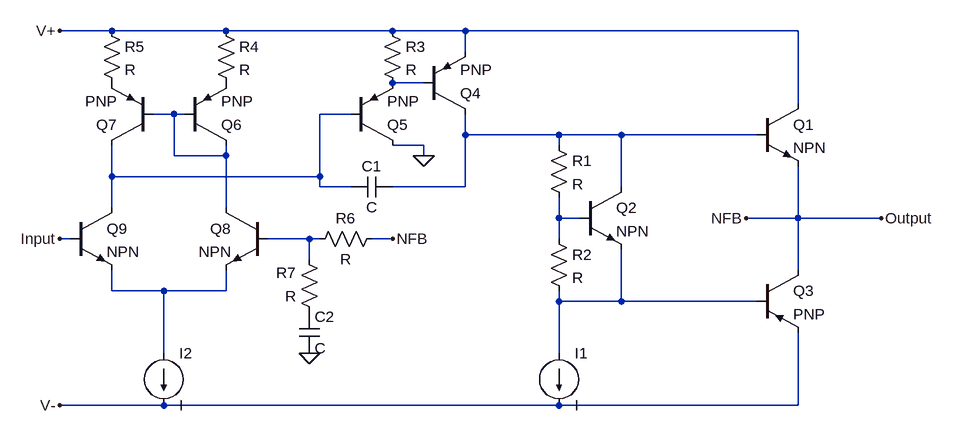
[diagram p0: schematic final_topology_pa.asc]
final_topology_pa.asc, the LTspice schematic file:
Version 4
SHEET 1 880 680
WIRE -576 -192 -656 -192
WIRE -400 -192 -576 -192
WIRE -144 -192 -400 -192
WIRE -32 -192 -144 -192
WIRE 480 -192 -32 -192
WIRE -32 -160 -32 -192
WIRE -96 -112 -144 -112
WIRE 480 -80 480 -192
WIRE -480 -64 -512 -64
WIRE -464 -64 -480 -64
WIRE -208 -64 -256 -64
WIRE -32 -32 -32 -64
WIRE 112 -32 -32 -32
WIRE 208 -32 112 -32
WIRE 416 -32 208 -32
WIRE -96 -16 -144 -16
WIRE 112 -16 112 -32
WIRE -480 0 -480 -64
WIRE -400 0 -400 -16
WIRE -400 0 -480 0
WIRE -96 0 -96 -16
WIRE -576 32 -576 -16
WIRE -256 32 -256 -64
WIRE -256 32 -576 32
WIRE -256 48 -256 32
WIRE -208 48 -256 48
WIRE -32 48 -32 -32
WIRE -32 48 -144 48
WIRE 208 48 208 -32
WIRE -576 80 -576 32
WIRE -400 80 -400 0
WIRE 112 96 112 64
WIRE 144 96 112 96
WIRE 480 96 480 16
WIRE 480 96 400 96
WIRE 608 96 480 96
WIRE -640 128 -656 128
WIRE -272 128 -336 128
WIRE -256 128 -272 128
WIRE -144 128 -176 128
WIRE 112 128 112 96
WIRE -272 160 -272 128
WIRE 480 176 480 96
WIRE -576 208 -576 176
WIRE -496 208 -576 208
WIRE -400 208 -400 176
WIRE -400 208 -496 208
WIRE 112 224 112 208
WIRE 208 224 208 144
WIRE 208 224 112 224
WIRE 416 224 208 224
WIRE -496 304 -496 208
WIRE 112 304 112 224
WIRE -496 384 -656 384
WIRE 112 384 -496 384
WIRE 480 384 480 272
WIRE 480 384 112 384
FLAG -96 0 0
FLAG 608 96 Output
FLAG 400 96 NFB
FLAG -272 304 0
FLAG -144 128 NFB
FLAG -656 128 Input
FLAG -656 -192 V+
FLAG -656 384 V-
SYMBOL npn 416 -80 R0
SYMATTR InstName Q1
SYMBOL npn 144 48 R0
SYMATTR InstName Q2
SYMBOL res 96 -32 R0
SYMATTR InstName R1
SYMBOL res 96 112 R0
SYMATTR InstName R2
SYMBOL pnp 416 176 R0
SYMATTR InstName Q3
SYMBOL current 112 304 R0
SYMATTR InstName I1
SYMBOL pnp -96 -64 M180
SYMATTR InstName Q4
SYMBOL pnp -208 -16 M180
SYMATTR InstName Q5
SYMBOL cap -144 32 R90
WINDOW 0 0 32 VBottom 2
WINDOW 3 32 32 VTop 2
SYMATTR InstName C1
SYMBOL res -160 -208 R0
SYMATTR InstName R3
SYMBOL pnp -464 -16 M180
SYMATTR InstName Q6
SYMBOL pnp -512 -16 R180
SYMATTR InstName Q7
SYMBOL npn -336 80 M0
SYMATTR InstName Q8
SYMBOL npn -640 80 R0
SYMATTR InstName Q9
SYMBOL res -416 -208 R0
SYMATTR InstName R4
SYMBOL res -592 -208 R0
SYMATTR InstName R5
SYMBOL current -496 304 R0
SYMATTR InstName I2
SYMBOL res -160 112 R90
WINDOW 0 0 56 VBottom 2
WINDOW 3 32 56 VTop 2
SYMATTR InstName R6
SYMBOL res -256 256 R180
WINDOW 0 36 76 Left 2
WINDOW 3 36 40 Left 2
SYMATTR InstName R7
SYMBOL cap -288 240 R0
SYMATTR InstName C2

The netlist it stands for:
* final_topology_pa.asc
Q1 V+ N004 NFB 0 NPN
Q2 N004 N005 N008 0 NPN
R1 N004 N005 R
R2 N005 N008 R
Q3 NFB N008 V- 0 PNP
I1 N008 V- I
Q4 N004 N001 V+ 0 PNP
Q5 0 N003 N001 0 PNP
C1 N004 N003 C
R3 V+ N001 R
Q6 N002 N002 P001 0 PNP
Q7 N003 N002 P002 0 PNP
Q8 N002 N006 N007 0 NPN
Q9 N003 Input N007 0 NPN
R4 V+ P001 R
R5 V+ P002 R
I2 N007 V- I
R6 NFB N006 R
R7 P003 N006 R
C2 P003 0 C
.model NPN NPN
.model PNP PNP
.lib standard.bjt
.backanno
.end